# Altium schematic sheet Webcam_Server_Wifi.SchDoc
size A
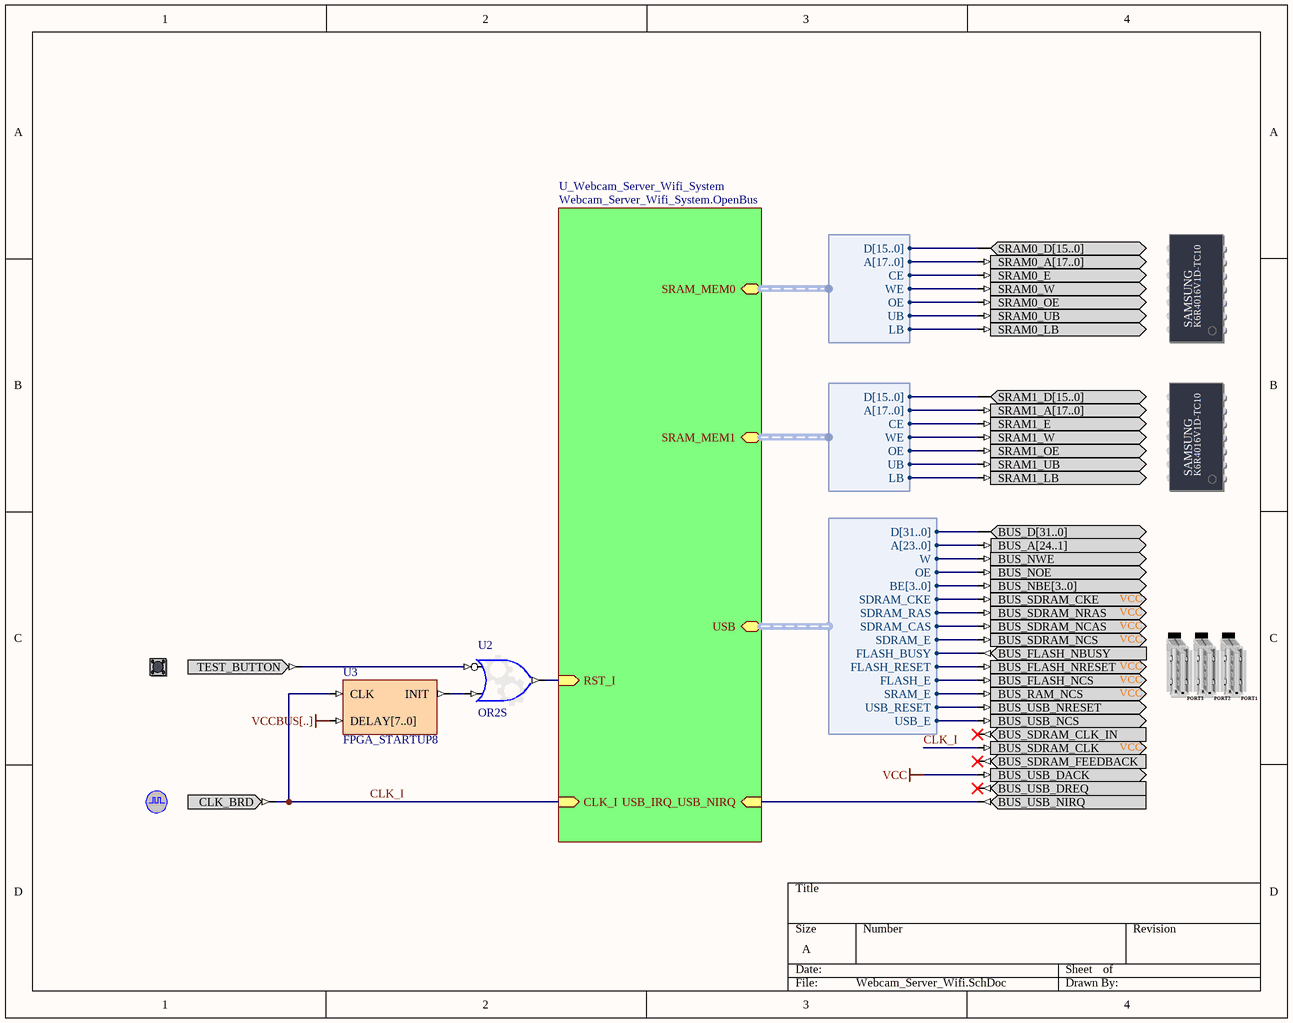
[diagram p0: Webcam_Server_Wifi.SchDoc]

## Parts
(Parts that share a designator on the sheet are numbered #1, #2 ... from top to bottom, then left to right.)
?#1  SRAM_DAUGHTER0  (value not drawn)
?#2  SRAM_DAUGHTER1  (value not drawn)
?#3  SHARED_USB  (value not drawn)
?#4  TEST_BUTTON  (value not drawn)
?#5  CLOCK_BOARD  (value not drawn)
U2  OR2S
U3  FPGA_STARTUP8

## Sub-sheets
U_Webcam_Server_Wifi_System = Webcam_Server_Wifi_System.OpenBus: SRAM_MEM0 (harness WB_MEM_CTRL_SRAM16_A18), SRAM_MEM1 (harness WB_MEM_CTRL_SRAM16_A18), RST_I (in), CLK_I (in), USB_IRQ_USB_NIRQ (in), USB (harness WB_SHARED_MEM_CTRL)

## Harnesses
WB_MEM_CTRL_SRAM16_A18: D[15..0], A[17..0], CE, WE, OE, UB, LB
WB_SHARED_MEM_CTRL: D[31..0], A[23..0], W, OE, BE[3..0], SDRAM_CKE, SDRAM_RAS, SDRAM_CAS, SDRAM_E, FLASH_BUSY, FLASH_RESET, FLASH_E, SRAM_E, USB_RESET, USB_E

## Nets
VCC: ?#3.BUS_USB_DACK
VCCBUS[..]: U3.DELAY[7..0]
CLK_I: ?#3.BUS_SDRAM_CLK ?#5.CLK_BRD U3.CLK ; sheet U_Webcam_Server_Wifi_System/CLK_I
Net?#1_SRAM0_A[17..0]: ?#1.SRAM0_A[17..0] ; sheet U_Webcam_Server_Wifi_System/SRAM_MEM0.A[17..0]
Net?#1_SRAM0_D[15..0]: ?#1.SRAM0_D[15..0] ; sheet U_Webcam_Server_Wifi_System/SRAM_MEM0.D[15..0]
Net?#1_SRAM0_E: ?#1.SRAM0_E ; sheet U_Webcam_Server_Wifi_System/SRAM_MEM0.CE
Net?#1_SRAM0_LB: ?#1.SRAM0_LB ; sheet U_Webcam_Server_Wifi_System/SRAM_MEM0.LB
Net?#1_SRAM0_OE: ?#1.SRAM0_OE ; sheet U_Webcam_Server_Wifi_System/SRAM_MEM0.OE
Net?#1_SRAM0_UB: ?#1.SRAM0_UB ; sheet U_Webcam_Server_Wifi_System/SRAM_MEM0.UB
Net?#1_SRAM0_W: ?#1.SRAM0_W ; sheet U_Webcam_Server_Wifi_System/SRAM_MEM0.WE
Net?#2_SRAM1_A[17..0]: ?#2.SRAM1_A[17..0] ; sheet U_Webcam_Server_Wifi_System/SRAM_MEM1.A[17..0]
Net?#2_SRAM1_D[15..0]: ?#2.SRAM1_D[15..0] ; sheet U_Webcam_Server_Wifi_System/SRAM_MEM1.D[15..0]
Net?#2_SRAM1_E: ?#2.SRAM1_E ; sheet U_Webcam_Server_Wifi_System/SRAM_MEM1.CE
Net?#2_SRAM1_LB: ?#2.SRAM1_LB ; sheet U_Webcam_Server_Wifi_System/SRAM_MEM1.LB
Net?#2_SRAM1_OE: ?#2.SRAM1_OE ; sheet U_Webcam_Server_Wifi_System/SRAM_MEM1.OE
Net?#2_SRAM1_UB: ?#2.SRAM1_UB ; sheet U_Webcam_Server_Wifi_System/SRAM_MEM1.UB
Net?#2_SRAM1_W: ?#2.SRAM1_W ; sheet U_Webcam_Server_Wifi_System/SRAM_MEM1.WE
Net?#3_BUS_A[24..1]: ?#3.BUS_A[24..1] ; sheet U_Webcam_Server_Wifi_System/USB.A[23..0]
Net?#3_BUS_D[31..0]: ?#3.BUS_D[31..0] ; sheet U_Webcam_Server_Wifi_System/USB.D[31..0]
Net?#3_BUS_FLASH_NBUSY: ?#3.BUS_FLASH_NBUSY ; sheet U_Webcam_Server_Wifi_System/USB.FLASH_BUSY
Net?#3_BUS_FLASH_NCS: ?#3.BUS_FLASH_NCS ; sheet U_Webcam_Server_Wifi_System/USB.FLASH_E
Net?#3_BUS_FLASH_NRESET: ?#3.BUS_FLASH_NRESET ; sheet U_Webcam_Server_Wifi_System/USB.FLASH_RESET
Net?#3_BUS_NBE[3..0]: ?#3.BUS_NBE[3..0] ; sheet U_Webcam_Server_Wifi_System/USB.BE[3..0]
Net?#3_BUS_NOE: ?#3.BUS_NOE ; sheet U_Webcam_Server_Wifi_System/USB.OE
Net?#3_BUS_NWE: ?#3.BUS_NWE ; sheet U_Webcam_Server_Wifi_System/USB.W
Net?#3_BUS_RAM_NCS: ?#3.BUS_RAM_NCS ; sheet U_Webcam_Server_Wifi_System/USB.SRAM_E
Net?#3_BUS_SDRAM_CKE: ?#3.BUS_SDRAM_CKE ; sheet U_Webcam_Server_Wifi_System/USB.SDRAM_CKE
Net?#3_BUS_SDRAM_NCAS: ?#3.BUS_SDRAM_NCAS ; sheet U_Webcam_Server_Wifi_System/USB.SDRAM_CAS
Net?#3_BUS_SDRAM_NCS: ?#3.BUS_SDRAM_NCS ; sheet U_Webcam_Server_Wifi_System/USB.SDRAM_E
Net?#3_BUS_SDRAM_NRAS: ?#3.BUS_SDRAM_NRAS ; sheet U_Webcam_Server_Wifi_System/USB.SDRAM_RAS
Net?#3_BUS_USB_NCS: ?#3.BUS_USB_NCS ; sheet U_Webcam_Server_Wifi_System/USB.USB_E
Net?#3_BUS_USB_NIRQ: ?#3.BUS_USB_NIRQ ; sheet U_Webcam_Server_Wifi_System/USB_IRQ_USB_NIRQ
Net?#3_BUS_USB_NRESET: ?#3.BUS_USB_NRESET ; sheet U_Webcam_Server_Wifi_System/USB.USB_RESET
Net?#4_TEST_BUTTON: ?#4.TEST_BUTTON U2.I0
NetU2_I1: U2.I1 U3.INIT
NetU2_O: U2.O ; sheet U_Webcam_Server_Wifi_System/RST_I

Not connected (* = marked no-connect by the designer): ?#3 BUS_SDRAM_CLK_IN* BUS_SDRAM_FEEDBACK* BUS_USB_DREQ*

## Notes on the sheet
- (in symbol SHARED_USB) VCC; USB2; PORT3; PORT2; PORT1
- (in symbol SRAM_DAUGHTER0) SAMSUNG; K6R4016V1D-TC10
- (in symbol SRAM_DAUGHTER1) SAMSUNG; K6R4016V1D-TC10

## Library data of the parts
?#1 = SRAM_DAUGHTER0: Free Static RAM - Daughterboard; PortComponent: True; Published: 14-May-2007; Publisher: Altium Limited; HelpURL: TR0149 Technical Reference for Altium's Xilinx Spartan-3 Daughter Board DB30.pdf#page=16
?#2 = SRAM_DAUGHTER1: Free Static RAM - Daughterboard; PortComponent: True; Published: 14-May-2007; Publisher: Altium Limited; HelpURL: TR0149 Technical Reference for Altium's Xilinx Spartan-3 Daughter Board DB30.pdf#page=16
?#3 = SHARED_USB: Common-Bus USB; PortComponent: True; Published: 14-May-2007; Publisher: Altium Limited; HelpURL: https://wiki.altium.com/display/ADOH/Accessing+Common-Bus+Resources+on+the+NanoBoard+3000
?#4 = TEST_BUTTON: Test / Reset Button; PortComponent: True; Published: 19-Nov-2003; Publisher: Altium Limited; HelpURL: TR0143 Technical Reference Manual for Altium's Desktop NanoBoard NB2DSK01.pdf#page=53
?#5 = CLOCK_BOARD: Global System Clock Supply; PortComponent: True; Published: 19-Nov-2003; Publisher: Altium Limited; HelpURL: TR0143 Technical Reference Manual for Altium's Desktop NanoBoard NB2DSK01.pdf#page=41; UseInDSF: True
U2 = GATE: Configurable Generic Gate; ConfiguratorName: GENERIC_GATE; ConfigurationParameters: {}Version[1.0]{}GateKind[OR]{}BusInput[False]{}GateInputType[Bit]{}GateOutputOption[Normal]{}BusWidth[8]{}RegisterOutputs[False]{}NegativeClockEdge[False]{}InputCount[2]{}InputInvert0[True]{}InputInvert1[False]{}; LastRevisionNo: 1.00.00; Published: 3-Sep-2008; Publisher: Altium Limited
U3 = FPGA_STARTUP8: FPGA Startup With 8 Bit Delay; Published: 9-Dec-2004; Publisher: Altium Limited; HelpURL: CR0119 FPGA_STARTUPx Powerup Delay Unit.pdf; LastRevisionNo: 1.00.00; ComponentLink1Description: Core &Resource Usage; ComponentLink1URL: CR0139 FPGA Peripheral Resource Usage.pdf#page=11